# Altium schematic sheet HDMI_Connector.SchDoc (part 2 of 2)
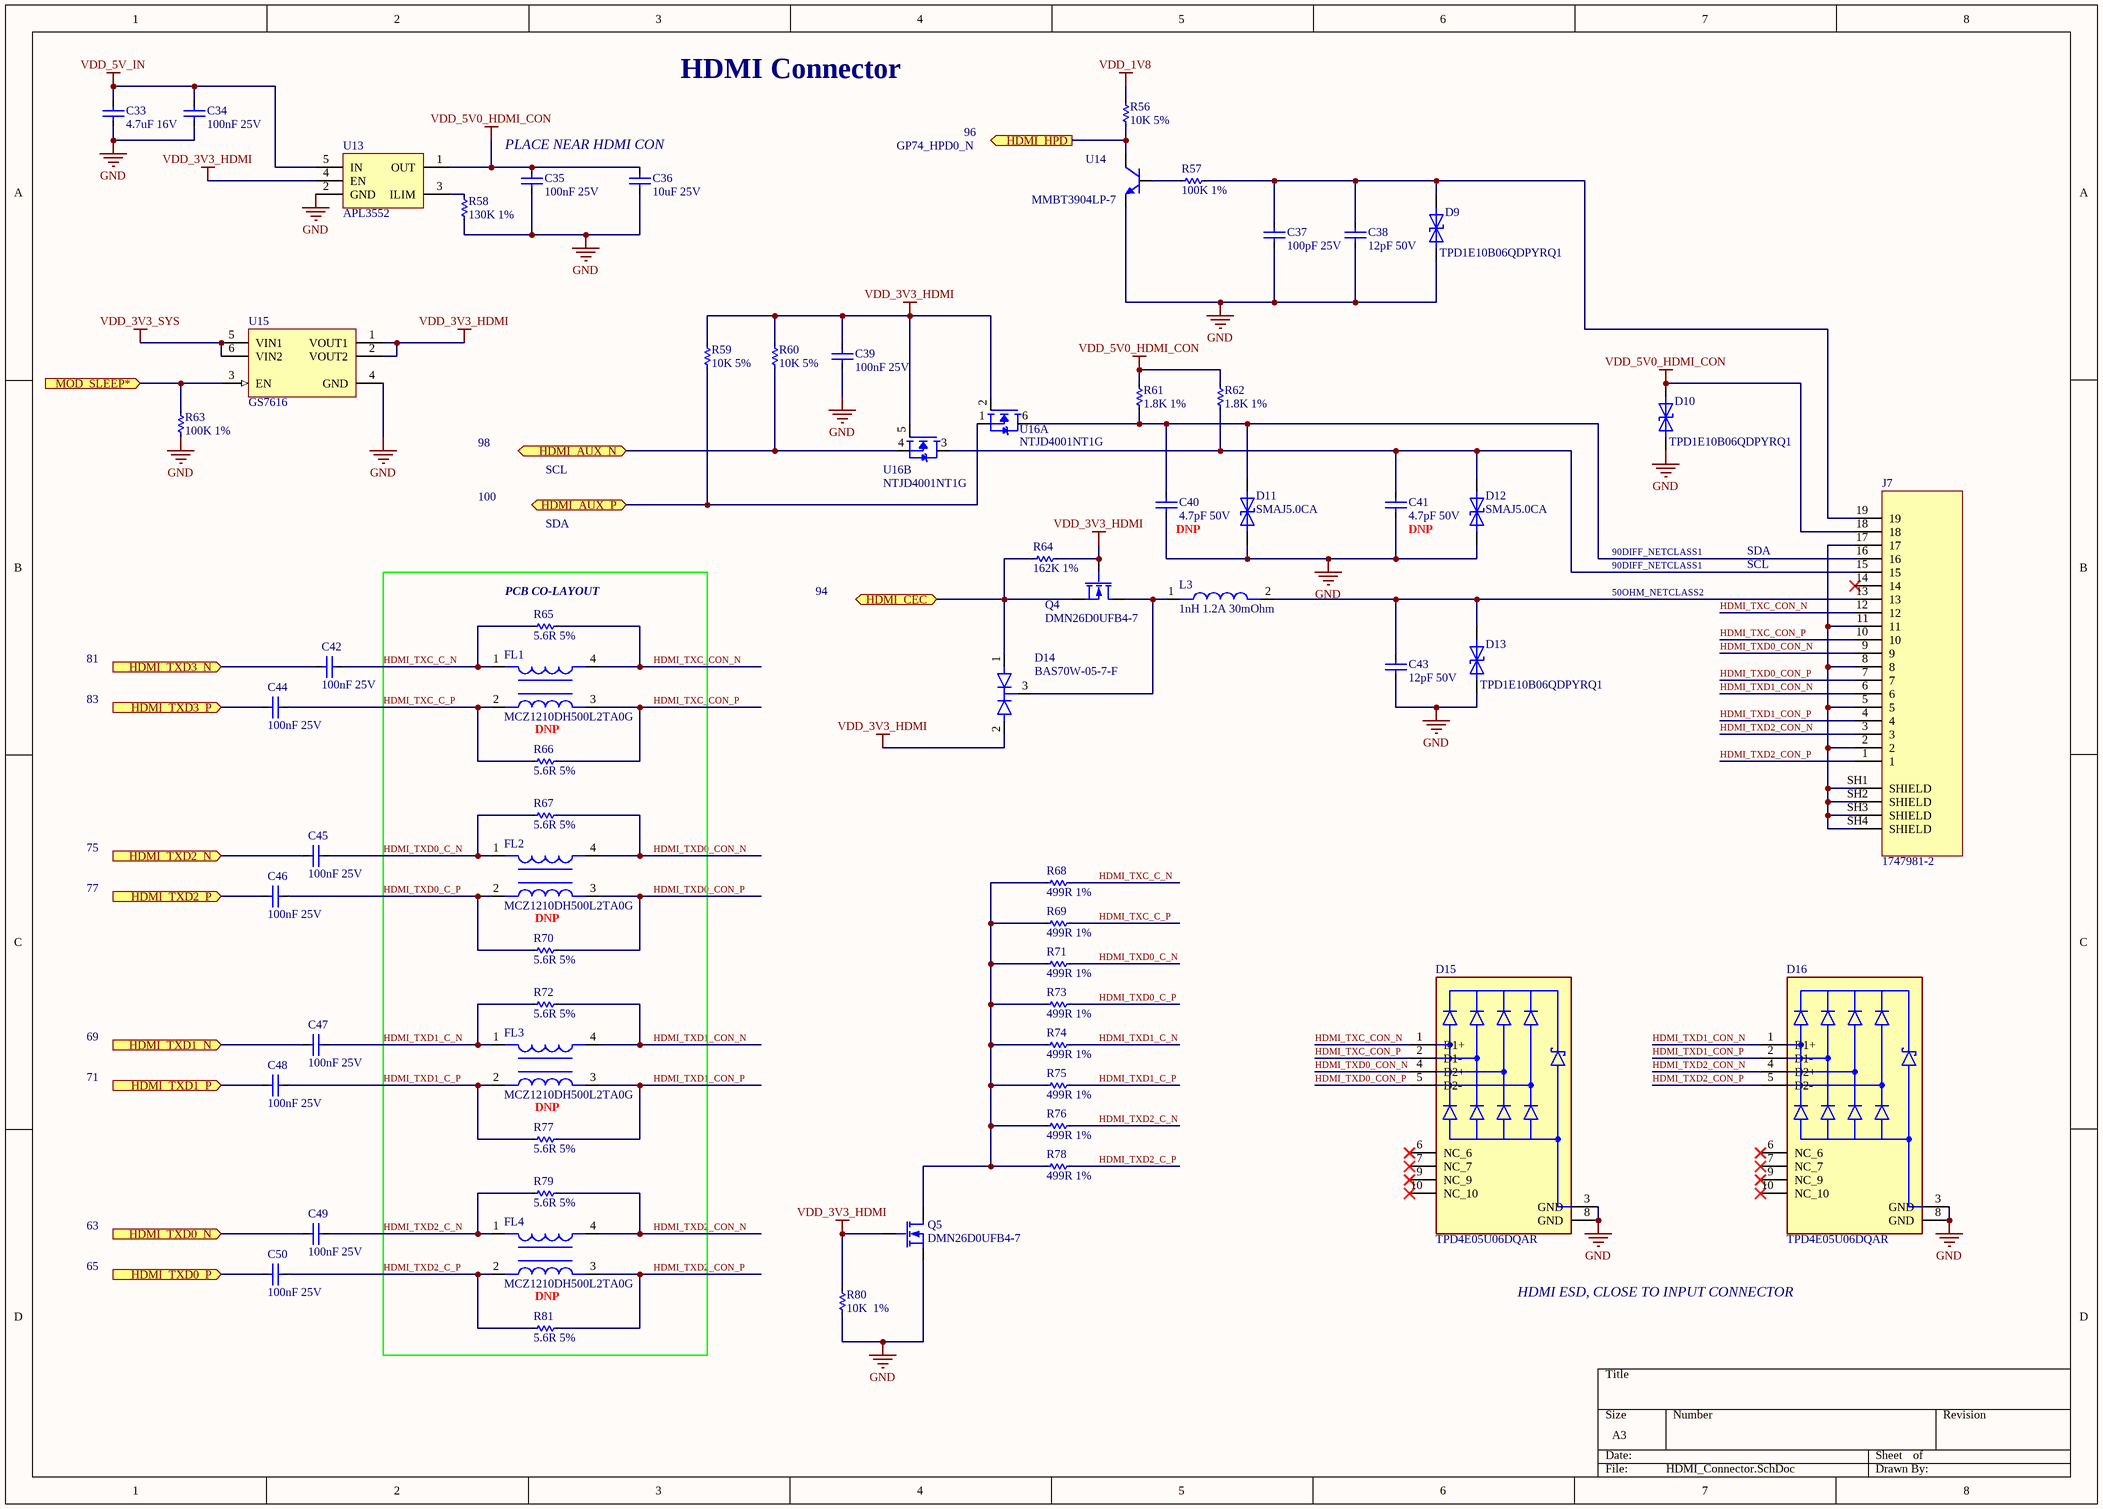
[diagram p1: HDMI_Connector.SchDoc]

## Library data of the parts
C33 = 0805YD475KAT2A: CAP CER 4.7UF 16V X5R 0805; Manufacturer: Kyocera AVX; Tolerance: 10%; Supplier 1: Digi-Key; Manufacturer Part Number: 0805YD475KAT2A; RoHS: Yes; Category: Ceramic Capacitors; Stock 1: 92659; Pricing 1: 1=0.70000, 10=0.49700, 50=0.37580, 100=0.32720, 500=0.24240, 1000=0.20604 (USD); Mount: Surface Mount; Case/Package: 0805; Number of Pins: 2; Case Code (Metric): 2012; Case Code (Imperial): 0805; Contact Plating: Tin,Matte; Min Operating Temperature: -55°C; Max Operating Temperature: 85°C; Package Quantity: 1; Capacitance: 4.7uF; Voltage Rating: 16V; Packaging: Tape and Reel; Voltage Rating (DC): 16V; Dielectric: X5R; Termination: SMD/SMT; Series: -; Construction: Flat; Length: 2.01mm; Width: 2.01mm; Height: 1.4mm; Thickness: 0.055inch; Depth: 1.25mm; Radiation Hardening: No; Reach SVHC Compliant: Yes; Lead Free: Lead Free; RoHS Compliant: Yes; ComponentLink1URL: https://datasheet.ciiva.com/16397/cx5r-16397167.pdf?src-supplier=Future+Electronics; ComponentLink1Description: https://datasheet.ciiva.com/16397/cx5r-16397167.pdf?src-supplier=Future+Electronics; ComponentLink2URL: https://datasheet.ciiva.com/7812/lt-7812221.pdf?src-supplier=Element14; ComponentLink2Description: https://datasheet.ciiva.com/7812/lt-7812221.pdf?src-supplier=Element14; ComponentLink3URL: https://datasheet.ciiva.com/7812/1598274-7812220.pdf?src-supplier=Element14; ComponentLink3Description: https://datasheet.ciiva.com/7812/1598274-7812220.pdf?src-supplier=Element14; ComponentLink4URL: https://datasheet.ciiva.com/22700/1796776-22700588.pdf?src-supplier=Element14; ComponentLink4Description: https://datasheet.ciiva.com/22700/1796776-22700588.pdf?src-supplier=Element14; ComponentLink5URL: https://datasheet.ciiva.com/7812/1666675-7812219.pdf?src-supplier=Element14; ComponentLink5Description: https://datasheet.ciiva.com/7812/1666675-7812219.pdf?src-supplier=Element14; ComponentLink6URL: https://datasheet.ciiva.com/153/cx5r-153889.pdf?src-supplier=Digi-Key; ComponentLink6Description: https://datasheet.ciiva.com/153/cx5r-153889.pdf?src-supplier=Digi-Key; ComponentLink7URL: https://datasheet.ciiva.com/153/cx5r-153888.pdf?src-supplier=Digi-Key; ComponentLink7Description: https://datasheet.ciiva.com/153/cx5r-153888.pdf?src-supplier=Digi-Key; ComponentLink8URL: https://datasheet.ciiva.com/153/cx5r-153890.pdf?src-supplier=Digi-Key; ComponentLink8Description: https://datasheet.ciiva.com/153/cx5r-153890.pdf?src-supplier=Digi-Key; Supplier Part Number 1: 478-5166-1-ND
C34 C35 C42 C44-C50 = 04023C104KAT2A: 0402 100 nF 25 V ±10 % Tolerance X7R Surface Mount Multilayer Ceramic Capacitor; Manufacturer: Kyocera AVX; Tolerance: 10%; Supplier 1: Digi-Key; Manufacturer Part Number: 04023C104KAT2A; RoHS: Yes; Category: Ceramic Capacitors; Stock 1: 3248475; Pricing 1: 1=0.10000, 10=0.03300, 50=0.01820, 100=0.01480, 500=0.01060, 1000=0.00833, 2500=0.00758, 5000=0.00697 (USD); Mount: Surface Mount; Case/Package: 0402; Number of Pins: 2; Case Code (Metric): 1005; Case Code (Imperial): 0402; Min Operating Temperature: -55°C; Max Operating Temperature: 125°C; Capacitance: 100nF; Packaging: Cut Tape; Dielectric: X7R; Voltage Rating (DC): 25V; Voltage Rating: 25V; Package Quantity: 1; Termination: SMD/SMT; Voltage: 25V; Series: -; Construction: Flat; Length: 1mm; Width: 1mm; Thickness: 0.022inch; Depth: 0.5mm; Radiation Hardening: No; Reach SVHC Compliant: Yes; Lead Free: Lead Free; RoHS Compliant: Yes; ComponentLink1URL: https://datasheet.ciiva.com/1123/1679506-1123344.pdf?src-supplier=Element14; ComponentLink1Description: https://datasheet.ciiva.com/1123/1679506-1123344.pdf?src-supplier=Element14; ComponentLink2URL: https://datasheet.ciiva.com/7614/cx7r-7614663.pdf?src-supplier=Digi-Key; ComponentLink2Description: https://datasheet.ciiva.com/7614/cx7r-7614663.pdf?src-supplier=Digi-Key; ComponentLink3URL: https://datasheet.ciiva.com/7709/1679506-7709527.pdf?src-supplier=Element14; ComponentLink3Description: https://datasheet.ciiva.com/7709/1679506-7709527.pdf?src-supplier=Element14; ComponentLink4URL: https://datasheet.ciiva.com/6265/cx7r-6265272.pdf?src-supplier=Digi-Key; ComponentLink4Description: https://datasheet.ciiva.com/6265/cx7r-6265272.pdf?src-supplier=Digi-Key; ComponentLink5URL: https://datasheet.ciiva.com/14906/cx7r-14906223.pdf?src-supplier=Digi-Key; ComponentLink5Description: https://datasheet.ciiva.com/14906/cx7r-14906223.pdf?src-supplier=Digi-Key; Supplier Part Number 1: 478-7868-1-ND
C36 = TMK212BBJ106KG-T: 0805 10 uF 25 V ±10% Tolerance X5R SMT Multilayer Ceramic Capacitor; Manufacturer: Taiyo Yuden; Dielectric: X7R; Voltage: 16V; Supplier 1: Digi-Key; Manufacturer Part Number: TMK212BBJ106KG-T; RoHS: Yes; Category: Ceramic Capacitors; Stock 1: 3515248; Pricing 1: 1=0.18000, 10=0.12400, 50=0.07460, 100=0.06290, 500=0.04306, 1000=0.03810 (USD); Mount: Surface Mount; Case/Package: 0805; Number of Pins: 2; Case Code (Metric): 2012; Case Code (Imperial): 0805; Min Operating Temperature: -55°C; Max Operating Temperature: 85°C; Capacitance: 10uF; Tolerance: 10%; Packaging: Tape and Reel; Voltage Rating (DC): 25V; Package Quantity: 1; Voltage Rating: 25V; Termination: SMD/SMT; Resistor Type: Ceramic; Series: M; Length: 0.079inch; Width: 0.049inch; Height: 1.25mm; Thickness: 0.053inch; Lead Free: Lead Free; Reach SVHC Compliant: Yes; RoHS Compliant: Yes; ComponentLink1URL: https://datasheet.ciiva.com/30062/tmk212bbj106kg-t-30062083.pdf?src-supplier=Onlinecomponents.com; ComponentLink1Description: https://datasheet.ciiva.com/30062/tmk212bbj106kg-t-30062083.pdf?src-supplier=Onlinecomponents.com; ComponentLink2URL: https://datasheet.ciiva.com/7975/1481447-7975820.pdf?src-supplier=Element14; ComponentLink2Description: https://datasheet.ciiva.com/7975/1481447-7975820.pdf?src-supplier=Element14; ComponentLink3URL: https://datasheet.ciiva.com/139/mlcc-all-e-139571.pdf?src-supplier=Digi-Key; ComponentLink3Description: https://datasheet.ciiva.com/139/mlcc-all-e-139571.pdf?src-supplier=Digi-Key; ComponentLink4URL: https://datasheet.ciiva.com/139/mlcc-all-e-139570.pdf?src-supplier=Digi-Key; ComponentLink4Description: https://datasheet.ciiva.com/139/mlcc-all-e-139570.pdf?src-supplier=Digi-Key; ComponentLink5URL: https://datasheet.ciiva.com/139/mlcc-all-e-139572.pdf?src-supplier=Digi-Key; ComponentLink5Description: https://datasheet.ciiva.com/139/mlcc-all-e-139572.pdf?src-supplier=Digi-Key; Supplier Part Number 1: 587-2985-1-ND
C37 = C0402C101J3GACTU: Cap Ceramic 100pF 25V C0G 5% SMD 0402 125C Paper T/R; Manufacturer: KEMET; Temperature Coefficient: 30ppm/°C; Dissipation Factor: 0.1%; Supplier 1: Digi-Key; Manufacturer Part Number: C0402C101J3GACTU; RoHS: Yes; Category: Ceramic Capacitors; Stock 1: 6224680; Pricing 1: 1=0.10000, 10=0.03100, 50=0.01700, 100=0.01390, 500=0.00990, 1000=0.00778, 2500=0.00707, 5000=0.00650 (USD); Mount: Surface Mount; Case/Package: 0402; Number of Pins: 2; Contact Plating: Tin,Matte; Dielectric Material: Ceramic; Case Code (Imperial): 0402; Case Code (Metric): 1005; Min Operating Temperature: -55°C; Max Operating Temperature: 125°C; Capacitance: 100pF; Tolerance: 5%; Packaging: Tape and Reel; Dielectric: C0G; Voltage Rating (DC): 25V; Package Quantity: 1; Voltage Rating: 25V; Termination: SMD/SMT; Voltage: 25V; Series: C0402C; Length: 1mm; Width: 0.02inch; Height: 0.5mm; Depth: 0.5mm; Thickness: 0.022inch; Lead Pitch: 0.3mm; Radiation Hardening: No; Lead Free: Lead Free; Reach SVHC Compliant: Yes; RoHS Compliant: Yes; ComponentLink1URL: http://components.arrow.com/part/dataview/2084787S8438145N7429?src-supplier=Arrow+Electronics; ComponentLink1Description: http://components.arrow.com/part/dataview/2084787S8438145N7429?src-supplier=Arrow+Electronics; ComponentLink2URL: http://www.jameco.com/Jameco/Products/ProdDS/1635286.pdf?src-supplier=Jameco; ComponentLink2Description: http://www.jameco.com/Jameco/Products/ProdDS/1635286.pdf?src-supplier=Jameco; ComponentLink3URL: http://www.farnell.com/datasheets/2739832.pdf?src-supplier=Farnell; ComponentLink3Description: http://www.farnell.com/datasheets/2739832.pdf?src-supplier=Farnell; ComponentLink4URL: http://uk.rs-online.com/webdocs/1443/0900766b81443d93.pdf?src-supplier=RSComponents; ComponentLink4Description: http://uk.rs-online.com/webdocs/1443/0900766b81443d93.pdf?src-supplier=RSComponents; ComponentLink5URL: http://www.mouser.com/ds/2/212/KEM_C1003_C0G_SMD-1101588.pdf?src-supplier=Mouser; ComponentLink5Description: http://www.mouser.com/ds/2/212/KEM_C1003_C0G_SMD-1101588.pdf?src-supplier=Mouser; ComponentLink6URL: http://uk.rs-online.com/webdocs/1443/0900766b81443d94.pdf?src-supplier=RSComponents; ComponentLink6Description: http://uk.rs-online.com/webdocs/1443/0900766b81443d94.pdf?src-supplier=RSComponents; ComponentLink7URL: http://www.farnell.com/datasheets/2739832.pdf?src-supplier=Newark; ComponentLink7Description: http://www.farnell.com/datasheets/2739832.pdf?src-supplier=Newark; ComponentLink8URL: http://www.farnell.com/datasheets/2739832.pdf?src-supplier=Element14; ComponentLink8Description: http://www.farnell.com/datasheets/2739832.pdf?src-supplier=Element14; ComponentLink9URL: https://api.kemet.com/component-edge/download/datasheet/C0402C101J3GACTU.pdf?src-supplier=Digi-Key; ComponentLink9Description: https://api.kemet.com/component-edge/download/datasheet/C0402C101J3GACTU.pdf?src-supplier=Digi-Key; ComponentLink10URL: http://www.farnell.com/datasheets/1372242.pdf?src-supplier=Element14; ComponentLink10Description: http://www.farnell.com/datasheets/1372242.pdf?src-supplier=Element14; Supplier Part Number 1: 399-C0402C101J3GAC7867CT-ND
C38 C43 = CC0402JRNPO9BN120: 0402 12 pF 50 V ±5 % Tolerance NP0 SMT Multilayer Ceramic Capacitor; Manufacturer: Yageo; Tolerance: 5%; Dielectric: C0G; Supplier 1: Digi-Key; Manufacturer Part Number: CC0402JRNPO9BN120; RoHS: Yes; Category: Ceramic Capacitors; Stock 1: 3125525; Pricing 1: 1=0.10000, 10=0.01800, 50=0.01000, 100=0.00820, 500=0.00584, 1000=0.00458, 2500=0.00417, 5000=0.00383 (USD); Mount: Surface Mount; Case/Package: 0402; Number of Pins: 2; Case Code (Metric): 1005; Case Code (Imperial): 0402; Min Operating Temperature: -55°C; Max Operating Temperature: 125°C; Package Quantity: 1; Capacitance: 12pF; Voltage Rating: 50V; Packaging: Tape and Reel; Voltage Rating (DC): 50V; Termination: SMD/SMT; Resistor Type: Ceramic; Series: CC; Length: 1mm; Width: 0.02inch; Height: 0.5mm; Thickness: 0.022inch; Depth: 0.5mm; Radiation Hardening: No; Reach SVHC Compliant: Yes; Lead Free: Lead Free; RoHS Compliant: Yes; ComponentLink1URL: https://datasheet.ciiva.com/28450/1443161-28450222.pdf?src-supplier=Element14; ComponentLink1Description: https://datasheet.ciiva.com/28450/1443161-28450222.pdf?src-supplier=Element14; ComponentLink2URL: https://datasheet.ciiva.com/161/mlccorderingcode-161487.pdf?src-supplier=Digi-Key; ComponentLink2Description: https://datasheet.ciiva.com/161/mlccorderingcode-161487.pdf?src-supplier=Digi-Key; ComponentLink3URL: https://datasheet.ciiva.com/161/mlccorderingcode-161486.pdf?src-supplier=Digi-Key; ComponentLink3Description: https://datasheet.ciiva.com/161/mlccorderingcode-161486.pdf?src-supplier=Digi-Key; ComponentLink4URL: https://datasheet.ciiva.com/161/mlccorderingcode-161488.pdf?src-supplier=Digi-Key; ComponentLink4Description: https://datasheet.ciiva.com/161/mlccorderingcode-161488.pdf?src-supplier=Digi-Key; ComponentLink5URL: https://datasheet.ciiva.com/5425/upy-gp-np0-16v-to-50v-8-5425431.pdf?src-supplier=Mouser; ComponentLink5Description: https://datasheet.ciiva.com/5425/upy-gp-np0-16v-to-50v-8-5425431.pdf?src-supplier=Mouser; ComponentLink6URL: https://datasheet.ciiva.com/11587/upy-gp-np0-16v-to-50v-8-11587083.pdf?src-supplier=Avnet; ComponentLink6Description: https://datasheet.ciiva.com/11587/upy-gp-np0-16v-to-50v-8-11587083.pdf?src-supplier=Avnet; Supplier Part Number 1: 311-1016-1-ND
C39 = TMK105BJ104KV-F: CAP CER 0.1UF 25V X5R 0402 / High Value Multilayer Ceramic Capacitors (High dielectric type); Manufacturer: Taiyo Yuden; Tolerance: 10%; Supplier 1: Digi-Key; Manufacturer Part Number: TMK105BJ104KV-F; RoHS: Yes; Category: Ceramic Capacitors; Stock 1: 11997960; Pricing 1: 1=0.10000, 10=0.03700, 50=0.02000, 100=0.01630, 500=0.01166, 1000=0.00917, 2500=0.00833, 5000=0.00767 (USD); Mount: Surface Mount; Case/Package: 0402; Number of Pins: 2; Case Code (Imperial): 0402; Case Code (Metric): 1005; Weight: 2.3E-05oz; Min Operating Temperature: -55°C; Max Operating Temperature: 85°C; Capacitance: 100nF; Packaging: Tape and Reel; Dielectric: X5R; Voltage Rating (DC): 25V; Voltage Rating: 25V; Package Quantity: 1; Termination: SMD/SMT; Resistor Type: Ceramic; Voltage: 25V; Series: M; Construction: Flat; Length: 1mm; Width: 0.02inch; Height: 0.5mm; Depth: 0.5mm; Thickness: 0.022inch; Reach SVHC Compliant: Yes; Lead Free: Lead Free; Halogen Free: Halogen Free; RoHS Compliant: Yes; Supplier Part Number 1: 587-1456-1-ND
C40 C41 = CC0402CRNPO9BN4R7: Surface Mount Ceramic Multilayer Capacitor 4.7pF 0.25pF C0G 50V 0402 Paper T/R; Manufacturer: Yageo; Insulation Resistance: 100GR; Supplier 1: Digi-Key; Manufacturer Part Number: CC0402CRNPO9BN4R7; RoHS: Yes; Category: Ceramic Capacitors; Stock 1: 401130; Pricing 1: 1=0.10000, 10=0.02400, 50=0.01300, 100=0.01070, 500=0.00764, 1000=0.00600, 2500=0.00546, 5000=0.00502 (USD); Mount: Surface Mount; Case/Package: 0402; Case Code (Metric): 1005; Case Code (Imperial): 0402; Weight: 2.3E-05oz; Dielectric Material: Ceramic; Min Operating Temperature: -55°C; Max Operating Temperature: 125°C; Package Quantity: 1; Capacitance: 4.7pF; Voltage Rating: 50V; Packaging: Tape and Reel; Voltage Rating (DC): 50V; Dielectric: C0G; Termination: SMD/SMT; Resistor Type: Ceramic; Series: CC; Length: 1mm; Width: 0.02inch; Height: 0.5mm; Thickness: 0.022inch; Depth: 0.5mm; Radiation Hardening: No; Reach SVHC Compliant: Yes; Lead Free: Lead Free; RoHS Compliant: Yes; ComponentLink1URL: https://datasheet.ciiva.com/7656/1132289-7656607.pdf?src-supplier=Element14; ComponentLink1Description: https://datasheet.ciiva.com/7656/1132289-7656607.pdf?src-supplier=Element14; ComponentLink2URL: https://datasheet.ciiva.com/8033/1443161-8033575.pdf?src-supplier=Element14; ComponentLink2Description: https://datasheet.ciiva.com/8033/1443161-8033575.pdf?src-supplier=Element14; ComponentLink3URL: https://datasheet.ciiva.com/8033/1443161-8033577.pdf?src-supplier=Element14; ComponentLink3Description: https://datasheet.ciiva.com/8033/1443161-8033577.pdf?src-supplier=Element14; ComponentLink4URL: https://datasheet.ciiva.com/144/mlccorderingcode-144017.pdf?src-supplier=Digi-Key; ComponentLink4Description: https://datasheet.ciiva.com/144/mlccorderingcode-144017.pdf?src-supplier=Digi-Key; ComponentLink5URL: https://datasheet.ciiva.com/144/mlccorderingcode-144016.pdf?src-supplier=Digi-Key; ComponentLink5Description: https://datasheet.ciiva.com/144/mlccorderingcode-144016.pdf?src-supplier=Digi-Key; ComponentLink6URL: https://datasheet.ciiva.com/144/mlccorderingcode-144018.pdf?src-supplier=Digi-Key; ComponentLink6Description: https://datasheet.ciiva.com/144/mlccorderingcode-144018.pdf?src-supplier=Digi-Key; ComponentLink7URL: https://datasheet.ciiva.com/11587/upy-gp-np0-16v-to-50v-8-11587178.pdf?src-supplier=Avnet; ComponentLink7Description: https://datasheet.ciiva.com/11587/upy-gp-np0-16v-to-50v-8-11587178.pdf?src-supplier=Avnet; ComponentLink8URL: https://datasheet.ciiva.com/26862/getdatasheetpartid-403435-26862581.pdf?src-supplier=Verical; ComponentLink8Description: https://datasheet.ciiva.com/26862/getdatasheetpartid-403435-26862581.pdf?src-supplier=Verical; Supplier Part Number 1: 311-1367-1-ND
D9 D10 D13 = TPD1E10B06QDPYRQ1: Automotive 12-pF, ±5.5V ±30-kV ESD protection diode in 0402 Package 2-X1SON -40 to 125; Manufacturer: Texas Instruments; Capacitance: 12pF; Number of Channels: 1; Supplier 1: Mouser; Manufacturer Part Number: TPD1E10B06QDPYRQ1; RoHS: Yes; Category: TVS Diodes; Stock 1: 130973; Pricing 1: 1=0.46000, 10=0.34900, 50=0.34900, 100=0.21800, 1000=0.11500, 10000=0.08800 (USD); Case/Package: 0402; Number of Pins: 2; Min Operating Temperature: -40°C; Max Operating Temperature: 125°C; Lead Free: Lead Free; RoHS Compliant: Yes; ComponentLink1URL: http://www.ti.com/lit/ds/symlink/tpd1e10b06-q1.pdf?src-supplier=Digi-Key; ComponentLink1Description: http://www.ti.com/lit/ds/symlink/tpd1e10b06-q1.pdf?src-supplier=Digi-Key; ComponentLink2URL: http://www.ti.com/general/docs/suppproductinfo.tsp?distId=10&amp;gotoUrl=http%3A%2F%2Fwww.ti.com%2Flit%2Fgpn%2Ftpd1e10b06-q1&src-supplier=Digi-Key; ComponentLink2Description: http://www.ti.com/general/docs/suppproductinfo.tsp?distId=10&amp;gotoUrl=http%3A%2F%2Fwww.ti.com%2Flit%2Fgpn%2Ftpd1e10b06-q1&src-supplier=Digi-Key; Supplier Part Number 1: 595-PD1E10B06QDPYRQ1
D11 D12 = SMAJ5.0CA: Transient Voltage Suppressor, TVS, SMAJ Series, Bidirectional, 5 V, DO-214AC, 2, 6.4 V RoHS Compliant: Yes; Manufacturer: Littelfuse; Reverse Breakdown Voltage: 6.4V; Operating Supply Voltage: 5V; Max Surge Current: 43.5A; Number of Elements: 1; Clamping Voltage: 9.2V; Peak Pulse Power: 400W; Power Line Protection: No; Test Current: 10mA; Max Reverse Leakage Current: 800uA; Max Breakdown Voltage: 7V; Max Power Dissipation: 3.3W; Element Configuration: Single; Leakage Current: 1.6mA; Capacitance: 1.05nF; Diode Type: ZENER; Supplier 1: Digi-Key; Manufacturer Part Number: SMAJ5.0CA; RoHS: Yes; Category: TVS Diodes; Stock 1: 526420; Pricing 1: 1=0.43000, 10=0.32000, 100=0.19950, 500=0.13650, 1000=0.10500, 2000=0.09450 (USD); Mount: Surface Mount; Case/Package: DO-214AC; Number of Pins: 2; Min Operating Temperature: -65°C; Max Operating Temperature: 150°C; Package Quantity: 5000; Direction: Bidirectional; Packaging: Tape and Reel; Number of Bidirectional Channels: 1; Reverse Standoff Voltage: 5V; Min Breakdown Voltage: 6.4V; Breakdown Voltage: 6.4V; Number of Channels: 1; Polarity: Bidirectional; Termination: SMD/SMT; Peak Pulse Current: 43.5A; Power Dissipation: 400W; Voltage Rating (DC): 5V; Max Output Current: 43.5A; Resistor Type: Zener; Series: SMAJ; Clamping Voltage-Max: 9.2V; Length: 4.5mm; Width: 2.79mm; Height: 2.087mm; Radiation Hardening: No; Reach SVHC Compliant: Yes; Lead Free: Lead Free; RoHS Compliant: Yes; ComponentLink1URL: https://datasheet.ciiva.com/25624/0900766b810f4edb-25624837.pdf?src-supplier=Rs; ComponentLink1Description: https://datasheet.ciiva.com/25624/0900766b810f4edb-25624837.pdf?src-supplier=Rs; ComponentLink2URL: https://datasheet.ciiva.com/28473/607617-28473438.pdf?src-supplier=Element14; ComponentLink2Description: https://datasheet.ciiva.com/28473/607617-28473438.pdf?src-supplier=Element14; ComponentLink3URL: https://datasheet.ciiva.com/16206/littelfuse-tvs-diode-smaj-16206104.pdf?src-supplier=Future+Electronics; ComponentLink3Description: https://datasheet.ciiva.com/16206/littelfuse-tvs-diode-smaj-16206104.pdf?src-supplier=Future+Electronics; ComponentLink4URL: https://datasheet.ciiva.com/331/littelfuse-tvs-diode-smaj-datasheet-pdf-331055.pdf?src-supplier=Digi-Key; ComponentLink4Description: https://datasheet.ciiva.com/331/littelfuse-tvs-diode-smaj-datasheet-pdf-331055.pdf?src-supplier=Digi-Key; ComponentLink5URL: https://datasheet.ciiva.com/331/littelfuse-tvs-diode-smaj-datasheet-pdf-331056.pdf?src-supplier=Digi-Key; ComponentLink5Description: https://datasheet.ciiva.com/331/littelfuse-tvs-diode-smaj-datasheet-pdf-331056.pdf?src-supplier=Digi-Key; ComponentLink6URL: https://datasheet.ciiva.com/331/littelfuse-tvs-diode-smaj-datasheet-pdf-331054.pdf?src-supplier=Digi-Key; ComponentLink6Description: https://datasheet.ciiva.com/331/littelfuse-tvs-diode-smaj-datasheet-pdf-331054.pdf?src-supplier=Digi-Key; Supplier Part Number 1: SMAJ5.0CALFCT-ND
D14 = BAS70W-05-7-F: DIODE ARRAY SCHOTTKY 70V SOT323; Manufacturer: Diodes; Element Configuration: Common Cathode; Max Power Dissipation: 200mW; Forward Current: 70mA; Forward Voltage: 1V; Reverse Recovery Time: 5ns; Max Forward Surge Current (Ifsm): 100mA; Max Reverse Current: 100nA; Capacitance: 2pF; Supplier 1: Digi-Key; Manufacturer Part Number: BAS70W-05-7-F; RoHS: Yes; Category: Schottky Diodes; Stock 1: 137048; Pricing 1: 1=0.37000, 10=0.30200, 100=0.16030, 500=0.10544, 1000=0.07170 (USD); Mount: Surface Mount; Case/Package: SOT-323; Number of Pins: 3; Weight: 0.000212oz; Contact Plating: Tin,Matte; Min Operating Temperature: -55°C; Max Operating Temperature: 125°C; Packaging: Tape and Reel; Package Quantity: 3000; Average Rectified Current: 70mA; Max Repetitive Reverse Voltage (Vrrm): 70V; Peak Non-Repetitive Surge Current: 100mA; Power Dissipation: 200mW; Termination: SMD/SMT; Current Rating: 70mA; Power Rating: 200mW; Voltage Rating (DC): 70V; Max Reverse Voltage (DC): 70V; Series: -; Length: 2.2mm; Width: 1.35mm; Height: 1mm; Radiation Hardening: No; Lead Free: Lead Free; RoHS Compliant: Yes; ComponentLink1URL: https://datasheet.ciiva.com/4715/ds30113-42118-4715778.pdf?src-supplier=Mouser; ComponentLink1Description: https://datasheet.ciiva.com/4715/ds30113-42118-4715778.pdf?src-supplier=Mouser; ComponentLink2URL: https://datasheet.ciiva.com/8303/ds30113-8303106.pdf?src-supplier=Avnet; ComponentLink2Description: https://datasheet.ciiva.com/8303/ds30113-8303106.pdf?src-supplier=Avnet; ComponentLink3URL: https://datasheet.ciiva.com/6388/ds30113-6388462.pdf?src-supplier=Digi-Key; ComponentLink3Description: https://datasheet.ciiva.com/6388/ds30113-6388462.pdf?src-supplier=Digi-Key; Supplier Part Number 1: BAS70W-05FDICT-ND
D15 D16 = TPD4E05U06DQAR: Quad 0.5-pF, 5.5-V, ±12-kV ESD protection diode for USB, HDMI & High Speed Interfaces; Manufacturer: Texas Instruments; Direction: Unidirectional; Capacitance: 0.5pF; Number of Bidirectional Channels: 4; Reverse Standoff Voltage: 5.5V; Min Breakdown Voltage: 6V; Clamping Voltage: 14V; Peak Pulse Power: 40W; Power Line Protection: Yes; Leakage Current: 10nA; Peak Pulse Current: 2.5A; Interface: LVDS,USB,Ethernet,HDMI,PCIe,SATA; Supplier 1: Mouser; Manufacturer Part Number: TPD4E05U06DQAR; RoHS: Yes; Category: Integrated Circuits (ICs); Stock 1: 71744; Pricing 1: 1=0.66000, 10=0.58100, 50=0.54600, 100=0.44600, 1000=0.28200, 10000=0.25500 (USD); Mount: Surface Mount; Case/Package: SON; Number of Pins: 10; Contact Plating: Gold; Min Operating Temperature: -40°C; Max Operating Temperature: 125°C; Packaging: Tape and Reel; Package Quantity: 3000; Polarity: Unidirectional; Number of Channels: 4; Breakdown Voltage: 6V; Max Power Dissipation: 40W; Termination: SMD/SMT; Working Voltage: 5.5V; Operating Supply Voltage: 5.5V; Series: -; Number of Unidirectional Channels: 4; Length: 2.6mm; Depth: 1.1mm; Radiation Hardening: No; Reach SVHC Compliant: Yes; Lead Free: Lead Free; RoHS Compliant: Yes; ComponentLink1URL: https://datasheet.ciiva.com/15063/tpd4e05u06-15063653.pdf?src-supplier=Digi-Key; ComponentLink1Description: https://datasheet.ciiva.com/15063/tpd4e05u06-15063653.pdf?src-supplier=Digi-Key; ComponentLink2URL: https://datasheet.ciiva.com/24119/slvsbo7f-316827-24119436.pdf?src-supplier=Mouser; ComponentLink2Description: https://datasheet.ciiva.com/24119/slvsbo7f-316827-24119436.pdf?src-supplier=Mouser; ComponentLink3URL: https://datasheet.ciiva.com/26918/getdatasheetpartid-716763-26918024.pdf?src-supplier=Verical; ComponentLink3Description: https://datasheet.ciiva.com/26918/getdatasheetpartid-716763-26918024.pdf?src-supplier=Verical; ComponentLink4URL: https://datasheet.ciiva.com/15063/tpd4e05u06-15063654.pdf?src-supplier=Digi-Key; ComponentLink4Description: https://datasheet.ciiva.com/15063/tpd4e05u06-15063654.pdf?src-supplier=Digi-Key; ComponentLink5URL: https://datasheet.ciiva.com/15063/tpd4e05u06-15063655.pdf?src-supplier=Digi-Key; ComponentLink5Description: https://datasheet.ciiva.com/15063/tpd4e05u06-15063655.pdf?src-supplier=Digi-Key; ComponentLink6URL: https://datasheet.ciiva.com/29883/tpd4e05u06-29883798.pdf?src-supplier=Avnet; ComponentLink6Description: https://datasheet.ciiva.com/29883/tpd4e05u06-29883798.pdf?src-supplier=Avnet; Supplier Part Number 1: 595-TPD4E05U06DQAR
FL1-FL4 = MCZ1210DH500L2TA0G: 2 Line Common Mode Choke Surface Mount 50 Ohms 100mA DCR 2.5Ohm; Manufacturer: TDK; Number of Lines: 2; DC Resistance (DCR): 2.5R; Voltage Rating (DC): 5V; Supplier 1: Mouser; Manufacturer Part Number: MCZ1210DH500L2TA0G; RoHS: Yes; Category: Common Mode Chokes; Stock 1: 8170; Pricing 1: 1=0.64000, 10=0.62200, 50=0.62200, 100=0.49900, 1000=0.33900, 10000=0.24500 (USD); Mount: Surface Mount; Case Code (Metric): 3225; Case Code (Imperial): 1210; Min Operating Temperature: -40°C; Max Operating Temperature: 85°C; Packaging: Tape and Reel; Max Current Rating: 100mA; Length: 0.049inch; Width: 0.039inch; Height: 0.024inch; RoHS Compliant: Yes; ComponentLink1URL: https://product.tdk.com/info/en/catalog/datasheets/cmf_commercial_signal_mcz1210dh_en.pdf?ref_disty=digikey&src-supplier=Digi-Key; ComponentLink1Description: https://product.tdk.com/info/en/catalog/datasheets/cmf_commercial_signal_mcz1210dh_en.pdf?ref_disty=digikey&src-supplier=Digi-Key; Supplier Part Number 1: 810-MCZ1210DH500L2TG
J7 = 1747981-2: Conn HDMI RCP 19 POS 0.5mm Solder ST SMD 19 Terminal 1 Port T/R; Manufacturer: TE Connectivity; Supplier 1: Digi-Key; Manufacturer Part Number: 1747981-2; RoHS: Yes; Category: Audio / Video Connectors; Stock 1: 892; Pricing 1: 1=5.43000, 10=4.92700, 25=4.66640, 50=4.55780, 100=4.34080 (USD); ComponentLink1URL: https://datasheet.ciiva.com/851/eng-cd-1747981-f4-1747981-c-f4-851645.pdf?src-supplier=Digi-Key; ComponentLink1Description: https://datasheet.ciiva.com/851/eng-cd-1747981-f4-1747981-c-f4-851645.pdf?src-supplier=Digi-Key; ComponentLink2URL: https://datasheet.ciiva.com/3094/eng-ds-6-1773453-4-hdmi-qrg-1208-3094418.pdf?src-supplier=Avnet; ComponentLink2Description: https://datasheet.ciiva.com/3094/eng-ds-6-1773453-4-hdmi-qrg-1208-3094418.pdf?src-supplier=Avnet; Supplier Part Number 1: A130924CT-ND
L3 = LQG15WH1N0B02D: Inductor Chip 1nH 0.1nH Tolerance 2-Pin 0402 Paper T/R; Manufacturer: Murata; Supplier 1: Digi-Key; Manufacturer Part Number: LQG15WH1N0B02D; RoHS: Yes; Category: Fixed Inductors; Stock 1: 10694; Pricing 1: 1=0.27000, 10=0.24200, 25=0.21200, 50=0.18180, 100=0.16660, 250=0.15152, 500=0.14240, 1000=0.10908, 2500=0.10302 (USD); Supplier Part Number 1: 490-LQG15WH1N0B02DDKR-ND
Q4 Q5 = DMN26D0UFB4-7: Single N-Channel 20 V 350 mW Silicon Surface Mount Mosfet - DFN-3; Manufacturer: Diodes; Rise Time: 7.9ns; Rds On Max: 3R; Input Capacitance: 14.1pF; Continuous Drain Current (ID): 240mA; Drain to Source Resistance: 1.8R; Power Dissipation: 350mW; Turn-Off Delay Time: 13.4ns; Drain to Source Voltage (Vdss): 20V; Turn-On Delay Time: 3.8ns; Fall Time: 15.2ns; Number of Elements: 1; Gate to Source Voltage (Vgs): 10V; On-State Resistance: 10R; FET Type: 1 N-Channel; Supplier 1: Mouser; Manufacturer Part Number: DMN26D0UFB4-7; RoHS: Yes; Category: MOSFETs; Stock 1: 21043; Pricing 1: 1=0.38000, 10=0.32100, 50=0.32100, 100=0.17000, 1000=0.07700, 10000=0.05000 (USD); Mount: Surface Mount; Case/Package: DFN; Number of Pins: 3; Min Operating Temperature: -55°C; Max Operating Temperature: 150°C; Packaging: Tape and Reel; Package Quantity: 3000; Max Power Dissipation: 350mW; Element Configuration: Single; Number of Channels: 1; Polarity: N-CHANNEL; Series: -; Drain-source On Resistance-Max: 10R; Length: 1.05mm; Width: 0.65mm; Height: 0.35mm; Radiation Hardening: No; Reach SVHC Compliant: Yes; Lead Free: Lead Free; RoHS Compliant: Yes; ComponentLink1URL: https://datasheet.ciiva.com/4443/ds31775-89139-4443083.pdf?src-supplier=Mouser; ComponentLink1Description: https://datasheet.ciiva.com/4443/ds31775-89139-4443083.pdf?src-supplier=Mouser; ComponentLink2URL: https://datasheet.ciiva.com/11176/ds31775-11176556.pdf?src-supplier=Avnet; ComponentLink2Description: https://datasheet.ciiva.com/11176/ds31775-11176556.pdf?src-supplier=Avnet; ComponentLink3URL: https://datasheet.ciiva.com/16434/ds31775-16434037.pdf?src-supplier=Future+Electronics; ComponentLink3Description: https://datasheet.ciiva.com/16434/ds31775-16434037.pdf?src-supplier=Future+Electronics; ComponentLink4URL: https://datasheet.ciiva.com/48532/ds31775-48532486.pdf?src-supplier=Avnet; ComponentLink4Description: https://datasheet.ciiva.com/48532/ds31775-48532486.pdf?src-supplier=Avnet; ComponentLink5URL: https://datasheet.ciiva.com/934/ds31775-934573.pdf?src-supplier=Digi-Key; ComponentLink5Description: https://datasheet.ciiva.com/934/ds31775-934573.pdf?src-supplier=Digi-Key; ComponentLink6URL: https://datasheet.ciiva.com/934/ds31775-934574.pdf?src-supplier=Digi-Key; ComponentLink6Description: https://datasheet.ciiva.com/934/ds31775-934574.pdf?src-supplier=Digi-Key; ComponentLink7URL: https://datasheet.ciiva.com/934/ds31775-934572.pdf?src-supplier=Digi-Key; ComponentLink7Description: https://datasheet.ciiva.com/934/ds31775-934572.pdf?src-supplier=Digi-Key; Supplier Part Number 1: 621-DMN26D0UFB4-7
R56 R59 R60 = RC0402JR-0710KL: Res Thick Film 0402 10K Ohm 5% 0.063W(1/16W) ±100ppm/C Pad SMD T/R; Manufacturer: Yageo; Resistance: 10kR; Power Rating: 62.5mW; Voltage Rating: 50V; Temperature Coefficient: 100ppm/°C; Max Power Dissipation: 63mW; Supplier 1: Digi-Key; Manufacturer Part Number: RC0402JR-0710KL; RoHS: Yes; Category: Chip SMD Resistors; Stock 1: 41914415; Pricing 1: 1=0.10000, 10=0.01200, 100=0.00480, 1000=0.00214, 2500=0.00186, 5000=0.00154 (USD); Case/Package: 0402; Case Code (Metric): 1005; Case Code (Imperial): 0402; Size Code: 0402; Min Operating Temperature: -55°C; Max Operating Temperature: 155°C; Packaging: Tape and Reel; Tolerance: 5%; Package Quantity: 1; Resistor Type: Thick Film; Number of Terminations: 2; Termination: SMD/SMT; Features: Moisture Resistant; Series: RC; Resistance Tolerance: 5%; Construction: Rectangular; Length: 0.039inch; Width: 0.02inch; Height: 0.016inch; Depth: 0.5mm; Military Standard: Not; Lead Free: Lead Free; RoHS Compliant: Yes; ComponentLink1URL: https://datasheet.ciiva.com/2452/pyu-r-int-thick-7-2452627.pdf?src-supplier=Digi-Key; ComponentLink1Description: https://datasheet.ciiva.com/2452/pyu-r-int-thick-7-2452627.pdf?src-supplier=Digi-Key; ComponentLink2URL: https://datasheet.ciiva.com/2452/pyu-r-int-thick-7-2452628.pdf?src-supplier=Digi-Key; ComponentLink2Description: https://datasheet.ciiva.com/2452/pyu-r-int-thick-7-2452628.pdf?src-supplier=Digi-Key; ComponentLink3URL: https://datasheet.ciiva.com/2452/pyu-r-int-thick-7-2452626.pdf?src-supplier=Digi-Key; ComponentLink3Description: https://datasheet.ciiva.com/2452/pyu-r-int-thick-7-2452626.pdf?src-supplier=Digi-Key; Supplier Part Number 1: 311-10KJRCT-ND
R57 R63 = RC0402FR-07100KL: RES SMD 100K OHM 1% 1/16W 0402; Manufacturer: Yageo; Power Rating: 63mW; Voltage Rating: 50V; Resistance: 100kR; Temperature Coefficient: 100ppm/°C; Supplier 1: Digi-Key; Manufacturer Part Number: RC0402FR-07100KL; RoHS: Yes; Category: Chip SMD Resistors; Stock 1: 41082272; Pricing 1: 1=0.10000, 10=0.01400, 100=0.00580, 1000=0.00262, 2500=0.00228, 5000=0.00188 (USD); Case/Package: 0402; Case Code (Metric): 1005; Case Code (Imperial): 0402; Min Operating Temperature: -55°C; Max Operating Temperature: 155°C; Tolerance: 1%; Package Quantity: 1; Packaging: Tape and Reel; Resistor Type: Thick Film; Number of Terminations: 2; Termination: SMD/SMT; Max Power Dissipation: 63mW; Working Voltage: 50V; Features: Moisture Resistant; Series: RC; Resistance Tolerance: 1%; Construction: Rectangular; Technology: THICK FILM; Length: 0.039inch; Width: 0.02inch; Height: 0.016inch; Depth: 0.5mm; Reach SVHC Compliant: Yes; Military Standard: Not; Lead Free: Lead Free; RoHS Compliant: Yes; ComponentLink1URL: https://datasheet.ciiva.com/11819/0900766b80c66297-11819452.pdf?src-supplier=RSComponents; ComponentLink1Description: https://datasheet.ciiva.com/11819/0900766b80c66297-11819452.pdf?src-supplier=RSComponents; ComponentLink2URL: https://datasheet.ciiva.com/22747/1018594-22747509.pdf?src-supplier=Element14; ComponentLink2Description: https://datasheet.ciiva.com/22747/1018594-22747509.pdf?src-supplier=Element14; ComponentLink3URL: https://datasheet.ciiva.com/2453/pyu-r-int-thick-7-2453362.pdf?src-supplier=Digi-Key; ComponentLink3Description: https://datasheet.ciiva.com/2453/pyu-r-int-thick-7-2453362.pdf?src-supplier=Digi-Key; ComponentLink4URL: https://datasheet.ciiva.com/2453/pyu-r-int-thick-7-2453363.pdf?src-supplier=Digi-Key; ComponentLink4Description: https://datasheet.ciiva.com/2453/pyu-r-int-thick-7-2453363.pdf?src-supplier=Digi-Key; ComponentLink5URL: https://datasheet.ciiva.com/2453/pyu-r-int-thick-7-2453361.pdf?src-supplier=Digi-Key; ComponentLink5Description: https://datasheet.ciiva.com/2453/pyu-r-int-thick-7-2453361.pdf?src-supplier=Digi-Key; ComponentLink6URL: https://datasheet.ciiva.com/12667/pyu-rc0402-51-rohs-l-6-r-12667930.pdf?src-supplier=Mouser; ComponentLink6Description: https://datasheet.ciiva.com/12667/pyu-rc0402-51-rohs-l-6-r-12667930.pdf?src-supplier=Mouser; ComponentLink7URL: https://datasheet.ciiva.com/15189/getdatasheetpartid-323696-15189334.pdf?src-supplier=Verical; ComponentLink7Description: https://datasheet.ciiva.com/15189/getdatasheetpartid-323696-15189334.pdf?src-supplier=Verical; Supplier Part Number 1: 311-100KLRCT-ND
R58 = RC0402FR-07130KL: Res General Purpose Thick Film 0402 130k Ohm 1% 1/16W ±100ppm/°C Molded Paper T/R; Manufacturer: Yageo; Resistance: 130kR; Power Rating: 62.5mW; Voltage Rating: 50V; Max Power Dissipation: 63mW; Supplier 1: Digi-Key; Manufacturer Part Number: RC0402FR-07130KL; RoHS: Yes; Category: Chip SMD Resistors; Stock 1: 672965; Pricing 1: 1=0.10000, 10=0.01400, 100=0.00580, 1000=0.00262, 2500=0.00228, 5000=0.00188 (USD); Mount: Surface Mount; Case/Package: 0402; Case Code (Imperial): 0402; Case Code (Metric): 1005; Min Operating Temperature: -55°C; Max Operating Temperature: 155°C; Tolerance: 1%; Packaging: Tape and Reel; Resistor Type: Thick Film; Termination: SMD/SMT; Number of Terminations: 2; Temperature Coefficient: 100ppm/°C; Voltage Rating (DC): 50V; Working Voltage: 50V; Features: Moisture Resistant; Series: RC; Construction: Rectangular; Technology: THICK FILM; Length: 1mm; Width: 0.02inch; Height: 0.016inch; Depth: 0.5mm; Military Standard: Not; Lead Free: Lead Free; RoHS Compliant: Yes; ComponentLink1URL: https://datasheet.ciiva.com/11808/0900766b80c66297-11808424.pdf?src-supplier=Rs; ComponentLink1Description: https://datasheet.ciiva.com/11808/0900766b80c66297-11808424.pdf?src-supplier=Rs; ComponentLink2URL: https://datasheet.ciiva.com/5562/pyu-rc0402-51-rohs-l-6-r-5562533.pdf?src-supplier=Mouser; ComponentLink2Description: https://datasheet.ciiva.com/5562/pyu-rc0402-51-rohs-l-6-r-5562533.pdf?src-supplier=Mouser; ComponentLink3URL: https://datasheet.ciiva.com/15189/getdatasheetpartid-410466-15189350.pdf?src-supplier=Verical; ComponentLink3Description: https://datasheet.ciiva.com/15189/getdatasheetpartid-410466-15189350.pdf?src-supplier=Verical; ComponentLink4URL: https://datasheet.ciiva.com/16742/pyu-rc0402-51-rohs-l-6-r-16742777.pdf?src-supplier=Future+Electronics; ComponentLink4Description: https://datasheet.ciiva.com/16742/pyu-rc0402-51-rohs-l-6-r-16742777.pdf?src-supplier=Future+Electronics; Supplier Part Number 1: YAG2969CT-ND
R61 R62 = RC0402FR-071K8L: Res General Purpose Thick Film 0402 1.8K Ohm 1% 1/16W ±100ppm/°C Molded SMD Paper T/R; Manufacturer: Yageo; Power Rating: 63mW; Resistance: 1.8kR; Voltage Rating: 50V; Supplier 1: Digi-Key; Manufacturer Part Number: RC0402FR-071K8L; RoHS: Yes; Category: Chip SMD Resistors; Stock 1: 1261689; Pricing 1: 1=0.10000, 10=0.01400, 100=0.00580, 1000=0.00262, 2500=0.00228, 5000=0.00188 (USD); Case/Package: 0402; Case Code (Imperial): 0402; Case Code (Metric): 1005; Min Operating Temperature: -55°C; Max Operating Temperature: 155°C; Tolerance: 1%; Packaging: Tape and Reel; Termination: SMD/SMT; Resistor Type: Thick Film; Number of Terminations: 2; Temperature Coefficient: 100ppm/°C; Max Power Dissipation: 63mW; Features: Moisture Resistant; Series: RC; Construction: Rectangular; Resistance Tolerance: 1%; Package Quantity: 1; Technology: THICK FILM; Working Voltage: 50V; Length: 0.039inch; Width: 0.02inch; Height: 0.016inch; Depth: 0.5mm; Military Standard: Not; Lead Free: Lead Free; RoHS Compliant: Yes; ComponentLink1URL: https://datasheet.ciiva.com/11819/0900766b80c66297-11819472.pdf?src-supplier=Rs; ComponentLink1Description: https://datasheet.ciiva.com/11819/0900766b80c66297-11819472.pdf?src-supplier=Rs; ComponentLink2URL: https://datasheet.ciiva.com/2453/pyu-r-int-thick-7-2453530.pdf?src-supplier=Digi-Key; ComponentLink2Description: https://datasheet.ciiva.com/2453/pyu-r-int-thick-7-2453530.pdf?src-supplier=Digi-Key; ComponentLink3URL: https://datasheet.ciiva.com/2453/pyu-r-int-thick-7-2453531.pdf?src-supplier=Digi-Key; ComponentLink3Description: https://datasheet.ciiva.com/2453/pyu-r-int-thick-7-2453531.pdf?src-supplier=Digi-Key; ComponentLink4URL: https://datasheet.ciiva.com/2453/pyu-r-int-thick-7-2453529.pdf?src-supplier=Digi-Key; ComponentLink4Description: https://datasheet.ciiva.com/2453/pyu-r-int-thick-7-2453529.pdf?src-supplier=Digi-Key; ComponentLink5URL: https://datasheet.ciiva.com/12667/pyu-rc0402-51-rohs-l-6-r-12667431.pdf?src-supplier=Mouser; ComponentLink5Description: https://datasheet.ciiva.com/12667/pyu-rc0402-51-rohs-l-6-r-12667431.pdf?src-supplier=Mouser; ComponentLink6URL: https://datasheet.ciiva.com/7849/1018594-7849868.pdf?src-supplier=Element14; ComponentLink6Description: https://datasheet.ciiva.com/7849/1018594-7849868.pdf?src-supplier=Element14; ComponentLink7URL: https://datasheet.ciiva.com/7849/1018594-7849867.pdf?src-supplier=Element14; ComponentLink7Description: https://datasheet.ciiva.com/7849/1018594-7849867.pdf?src-supplier=Element14; ComponentLink8URL: https://datasheet.ciiva.com/16744/pyu-rc0402-51-rohs-l-6-r-16744223.pdf?src-supplier=Future+Electronics; ComponentLink8Description: https://datasheet.ciiva.com/16744/pyu-rc0402-51-rohs-l-6-r-16744223.pdf?src-supplier=Future+Electronics; Supplier Part Number 1: 311-1.80KLRDKR-ND
R64 = RC0402FR-07162KL: Res Thick Film 0402 162K Ohm 1% 1/16W ±100ppm/°C Molded SMD Paper T/R; Manufacturer: Yageo; Resistance: 162kR; Power Rating: 62.5mW; Voltage Rating: 50V; Max Power Dissipation: 63mW; Supplier 1: Mouser; Manufacturer Part Number: RC0402FR-07162KL; RoHS: Yes; Category: Chip SMD Resistors; Stock 1: 206933; Pricing 1: 1=0.10000, 10=0.01200, 50=0.01200, 100=0.00500, 1000=0.00300, 10000=0.00100 (USD); Case/Package: 0402; Case Code (Imperial): 0402; Case Code (Metric): 1005; Contact Plating: Tin,Matte; Size Code: 0402; Min Operating Temperature: -55°C; Max Operating Temperature: 155°C; Packaging: Tape and Reel; Tolerance: 1%; Package Quantity: 10000; Resistor Type: Thick Film; Number of Terminations: 2; Termination: SMD/SMT; Temperature Coefficient: 100ppm/°C; Voltage Rating (DC): 50V; Features: Moisture Resistant; Series: RC; Construction: Rectangular; Length: 1mm; Width: 0.02inch; Height: 0.016inch; Depth: 0.5mm; Military Standard: Not; Lead Free: Lead Free; RoHS Compliant: Yes; ComponentLink1URL: https://datasheet.ciiva.com/2452/pyu-r-int-thick-7-2452605.pdf?src-supplier=Digi-Key; ComponentLink1Description: https://datasheet.ciiva.com/2452/pyu-r-int-thick-7-2452605.pdf?src-supplier=Digi-Key; Supplier Part Number 1: 603-RC0402FR-07162KL
R65-R67 R70 R72 R77 R79 R81 = RC0402JR-075R6L: Res Thick Film 0402 5.6 Ohm 5% 1/16W ±200ppm/°C Molded SMD Paper T/R; Manufacturer: Yageo; Power Rating: 62.5mW; Voltage Rating: 50V; Max Power Dissipation: 63mW; Supplier 1: Digi-Key; Manufacturer Part Number: RC0402JR-075R6L; RoHS: Yes; Category: Chip SMD Resistors; Stock 1: 729483; Pricing 1: 1=0.10000, 10=0.01700, 100=0.00690, 1000=0.00310, 2500=0.00270, 5000=0.00223 (USD); Case/Package: 0402; Number of Pins: 2; Case Code (Metric): 1005; Case Code (Imperial): 0402; Contact Plating: Tin,Matte; Min Operating Temperature: -55°C; Max Operating Temperature: 155°C; Resistance: 5.6R; Tolerance: 5%; Package Quantity: 10000; Packaging: Tape and Reel; Resistor Type: Thick Film; Number of Terminations: 2; Termination: SMD/SMT; Temperature Coefficient: 200ppm/°C; Features: Moisture Resistant; Series: RC; Resistance Tolerance: 5%; Construction: Rectangular; Voltage Rating (DC): 50V; Working Voltage: 50V; Technology: THICK FILM; Length: 0.039inch; Width: 0.02inch; Height: 0.016inch; Depth: 0.5mm; Reach SVHC Compliant: Yes; Military Standard: Not; Lead Free: Lead Free; RoHS Compliant: Yes; ComponentLink1URL: https://datasheet.ciiva.com/2452/pyu-r-int-thick-7-2452711.pdf?src-supplier=Digi-Key; ComponentLink1Description: https://datasheet.ciiva.com/2452/pyu-r-int-thick-7-2452711.pdf?src-supplier=Digi-Key; ComponentLink2URL: https://datasheet.ciiva.com/2452/pyu-r-int-thick-7-2452712.pdf?src-supplier=Digi-Key; ComponentLink2Description: https://datasheet.ciiva.com/2452/pyu-r-int-thick-7-2452712.pdf?src-supplier=Digi-Key; ComponentLink3URL: https://datasheet.ciiva.com/2452/pyu-r-int-thick-7-2452710.pdf?src-supplier=Digi-Key; ComponentLink3Description: https://datasheet.ciiva.com/2452/pyu-r-int-thick-7-2452710.pdf?src-supplier=Digi-Key; ComponentLink4URL: https://datasheet.ciiva.com/8892/pyu-rc0402-51-rohs-l-6-8892550.pdf?src-supplier=Avnet; ComponentLink4Description: https://datasheet.ciiva.com/8892/pyu-rc0402-51-rohs-l-6-8892550.pdf?src-supplier=Avnet; ComponentLink5URL: https://datasheet.ciiva.com/16744/pyu-rc0402-51-rohs-l-6-r-16744231.pdf?src-supplier=Future+Electronics; ComponentLink5Description: https://datasheet.ciiva.com/16744/pyu-rc0402-51-rohs-l-6-r-16744231.pdf?src-supplier=Future+Electronics; Supplier Part Number 1: 311-5.6JRCT-ND
R68 R69 R71 R73-R76 R78 = RC0402FR-07499RL: Res General Purpose Thick Film 0402 499 Ohm 1% 1/16W ±100ppm/°C Molded SMD Paper T/R; Manufacturer: Yageo; Voltage Rating (DC): 50V; Power Rating: 62.5mW; Max Power Dissipation: 63mW; Supplier 1: Digi-Key; Manufacturer Part Number: RC0402FR-07499RL; RoHS: Yes; Category: Chip SMD Resistors; Stock 1: 3766935; Pricing 1: 1=0.10000, 10=0.01400, 100=0.00580, 1000=0.00262, 2500=0.00228, 5000=0.00188 (USD); Case/Package: 0402; Case Code (Metric): 1005; Case Code (Imperial): 0402; Size Code: 0402; Min Operating Temperature: -55°C; Max Operating Temperature: 155°C; Tolerance: 1%; Package Quantity: 1; Packaging: Tape and Reel; Features: Moisture Resistant; Resistance: 499R; Voltage Rating: 50V; Resistor Type: Thick Film; Number of Terminations: 2; Termination: SMD/SMT; Temperature Coefficient: 100ppm/°C; Series: RC; Resistance Tolerance: 1%; Construction: Rectangular; Length: 0.039inch; Width: 0.02inch; Height: 0.016inch; Depth: 0.5mm; Lead Free: Lead Free; Reach SVHC Compliant: Yes; Military Standard: Not; RoHS Compliant: Yes; ComponentLink1URL: https://datasheet.ciiva.com/2453/pyu-r-int-thick-7-2453539.pdf?src-supplier=Digi-Key; ComponentLink1Description: https://datasheet.ciiva.com/2453/pyu-r-int-thick-7-2453539.pdf?src-supplier=Digi-Key; ComponentLink2URL: https://datasheet.ciiva.com/2453/pyu-r-int-thick-7-2453540.pdf?src-supplier=Digi-Key; ComponentLink2Description: https://datasheet.ciiva.com/2453/pyu-r-int-thick-7-2453540.pdf?src-supplier=Digi-Key; ComponentLink3URL: https://datasheet.ciiva.com/2453/pyu-r-int-thick-7-2453538.pdf?src-supplier=Digi-Key; ComponentLink3Description: https://datasheet.ciiva.com/2453/pyu-r-int-thick-7-2453538.pdf?src-supplier=Digi-Key; Supplier Part Number 1: 311-499LRCT-ND
R80 = RC0402FR-0710KP: Res General Purpose Thick Film 0402 10K Ohm 1% 1/16W ±100ppm/°C Molded SMD Paper T/R; Manufacturer: Yageo; Resistance: 10kR; Max Power Dissipation: 63mW; Temperature Coefficient: 150ppm/°C; Supplier 1: Digi-Key; Manufacturer Part Number: RC0402FR-0710KP; RoHS: Yes; Category: Chip SMD Resistors; Stock 1: 1032587; Pricing 1: 1=0.10000, 10=0.03100, 100=0.01280, 1000=0.00573, 2500=0.00497, 5000=0.00411 (USD); Case/Package: 0402; Case Code (Metric): 1005; Case Code (Imperial): 0402; Min Operating Temperature: -55°C; Max Operating Temperature: 155°C; Packaging: Tape and Reel; Resistor Type: Thick Film; Number of Terminations: 2; Tolerance: 1%; Features: Moisture Resistant; Length: 0.039inch; Width: 0.02inch; Height: 0.016inch; RoHS Compliant: Yes; ComponentLink1URL: http://www.yageo.com/NewPortal/yageodocoutput?fileName=/pdf/R-Chip/PYu-RC_51_RoHS_P_0.pdf&src-supplier=Digi-Key; ComponentLink1Description: http://www.yageo.com/NewPortal/yageodocoutput?fileName=/pdf/R-Chip/PYu-RC_51_RoHS_P_0.pdf&src-supplier=Digi-Key; Supplier Part Number 1: YAG1249CT-ND
U13 = APL3552: The APL3552 series of power switches integrate a 62mW N-channel MOSFET.; ComponentLink1Description: Datasheet; ComponentLink1URL: https://datasheet.lcsc.com/lcsc/2004172033_Anpec-Elec-APL3552ACI-TRG_C503680.pdf
U14 = MMBT3904LP-7: TRANS NPN 40V 0.2A DFN1006-3; Manufacturer: Diodes; Max Power Dissipation: 250mW; Max Collector Current: 200mA; Transition Frequency: 300MHz; Collector Base Voltage (VCBO): 60V; Element Configuration: Single; Emitter Base Voltage (VEBO): 6V; Collector Emitter Saturation Voltage: 300mV; Supplier 1: Mouser; Manufacturer Part Number: MMBT3904LP-7; RoHS: Yes; Category: BJTs; Stock 1: 4838; Pricing 1: 1=0.41000, 10=0.30600, 50=0.30600, 100=0.19100, 1000=0.10100, 10000=0.07700 (USD); Mount: Surface Mount; Case/Package: DFN; Number of Pins: 3; Weight: 0.000282oz; Min Operating Temperature: -55°C; Max Operating Temperature: 150°C; Package Quantity: 3000; Packaging: Tape and Reel; Collector Emitter Voltage (VCEO): 40V; Collector Emitter Breakdown Voltage: 40V; Polarity: NPN; Gain Bandwidth Product: 300MHz; Continuous Collector Current: 200mA; Collector-emitter Voltage-Max: 300mV; Series: Automotive, AEC-Q101; Max Breakdown Voltage: 40V; Length: 1mm; Width: 0.6mm; Height: 0.5mm; Radiation Hardening: No; Lead Free: Lead Free; Reach SVHC Compliant: Yes; RoHS Compliant: Yes; ComponentLink1URL: https://datasheet.ciiva.com/12330/ds30036-41708-12330497.pdf?src-supplier=Mouser; ComponentLink1Description: https://datasheet.ciiva.com/12330/ds30036-41708-12330497.pdf?src-supplier=Mouser; ComponentLink2URL: https://datasheet.ciiva.com/11199/ds31835-11199001.pdf?src-supplier=Avnet; ComponentLink2Description: https://datasheet.ciiva.com/11199/ds31835-11199001.pdf?src-supplier=Avnet; ComponentLink3URL: https://datasheet.ciiva.com/11206/ds31835-11206492.pdf?src-supplier=Avnet; ComponentLink3Description: https://datasheet.ciiva.com/11206/ds31835-11206492.pdf?src-supplier=Avnet; ComponentLink4URL: https://datasheet.ciiva.com/16463/ds31835-16463047.pdf?src-supplier=Future+Electronics; ComponentLink4Description: https://datasheet.ciiva.com/16463/ds31835-16463047.pdf?src-supplier=Future+Electronics; ComponentLink5URL: https://datasheet.ciiva.com/18648/ds31835-18648085.pdf?src-supplier=Digi-Key; ComponentLink5Description: https://datasheet.ciiva.com/18648/ds31835-18648085.pdf?src-supplier=Digi-Key; Supplier Part Number 1: 621-MMBT3904LP-7
U15 = GS7616: The GS7616 Load Switch is a fast turn on Load Switch; the typical rise time is 300us. This device contains a NMOSFET that can operate over an input voltage range of 1.5V to 5.5V.; ComponentLink1Description: Datasheet; ComponentLink1URL: http://www.gstekic.com/pdf/GS7616ABCDE.pdf
U16 = NTJD4001NT1G: MOSFET 2N-CH 30V 0.25A SOT-363; Manufacturer: ON Semiconductor; Continuous Drain Current (ID): 250mA; Power Dissipation: 272mW; Drain to Source Resistance: 1.5R; Gate to Source Voltage (Vgs): 20V; Nominal Vgs: 1.2V; Input Capacitance: 33pF; Number of Elements: 2; Rise Time: 23ns; Turn-Off Delay Time: 94ns; Turn-On Delay Time: 17ns; On-State Resistance: 1R; Element Configuration: Dual; FET Type: 2 N-Channel; Polarity: N-CHANNEL; Polarization: N; Supplier 1: Digi-Key; Manufacturer Part Number: NTJD4001NT1G; RoHS: Yes; Category: MOSFETs; Stock 1: 305804; Pricing 1: 1=0.39000, 10=0.31500, 100=0.21470, 500=0.16104, 1000=0.12078 (USD); Case/Package: SOT-363-6; Number of Pins: 6; Contact Plating: Tin,Matte; Min Operating Temperature: -55°C; Max Operating Temperature: 150°C; Packaging: Tape and Reel; Drain to Source Voltage (Vdss): 30V; Drain to Source Breakdown Voltage: 30V; Voltage Rating (DC): 30V; Current Rating: 250mA; Max Power Dissipation: 272mW; Package Quantity: 1; Rds On Max: 1.5R; Fall Time: 23ns; Threshold Voltage: 1.2V; Series: -; Drain-source On Resistance-Max: 1R; Length: 0.086inch; Width: 0.053inch; Height: 0.039inch; Radiation Hardening: No; Reach SVHC Compliant: Yes; Lead Free: Lead Free; RoHS Compliant: Yes; ComponentLink1URL: https://datasheet.ciiva.com/30480/0900766b81206045-30480256.pdf?src-supplier=Rs; ComponentLink1Description: https://datasheet.ciiva.com/30480/0900766b81206045-30480256.pdf?src-supplier=Rs; ComponentLink2URL: https://datasheet.ciiva.com/8059/ntjd4001n-d-8059373.pdf?src-supplier=Element14; ComponentLink2Description: https://datasheet.ciiva.com/8059/ntjd4001n-d-8059373.pdf?src-supplier=Element14; ComponentLink3URL: https://datasheet.ciiva.com/8114/ntjd4001n-d-8114703.pdf?src-supplier=Avnet; ComponentLink3Description: https://datasheet.ciiva.com/8114/ntjd4001n-d-8114703.pdf?src-supplier=Avnet; ComponentLink4URL: https://datasheet.ciiva.com/11168/ntjd4001n-d-11168375.pdf?src-supplier=Avnet; ComponentLink4Description: https://datasheet.ciiva.com/11168/ntjd4001n-d-11168375.pdf?src-supplier=Avnet; ComponentLink5URL: https://datasheet.ciiva.com/929/ntjd4001n-d-929084.pdf?src-supplier=Digi-Key; ComponentLink5Description: https://datasheet.ciiva.com/929/ntjd4001n-d-929084.pdf?src-supplier=Digi-Key; ComponentLink6URL: https://datasheet.ciiva.com/929/ntjd4001n-d-929085.pdf?src-supplier=Digi-Key; ComponentLink6Description: https://datasheet.ciiva.com/929/ntjd4001n-d-929085.pdf?src-supplier=Digi-Key; ComponentLink7URL: https://datasheet.ciiva.com/929/ntjd4001n-d-929083.pdf?src-supplier=Digi-Key; ComponentLink7Description: https://datasheet.ciiva.com/929/ntjd4001n-d-929083.pdf?src-supplier=Digi-Key; Supplier Part Number 1: NTJD4001NT1GOSCT-ND